# EAGLE design esp12StackFTDI_1 (EAGLE 7.7.0)

## Sheet 1 of 2
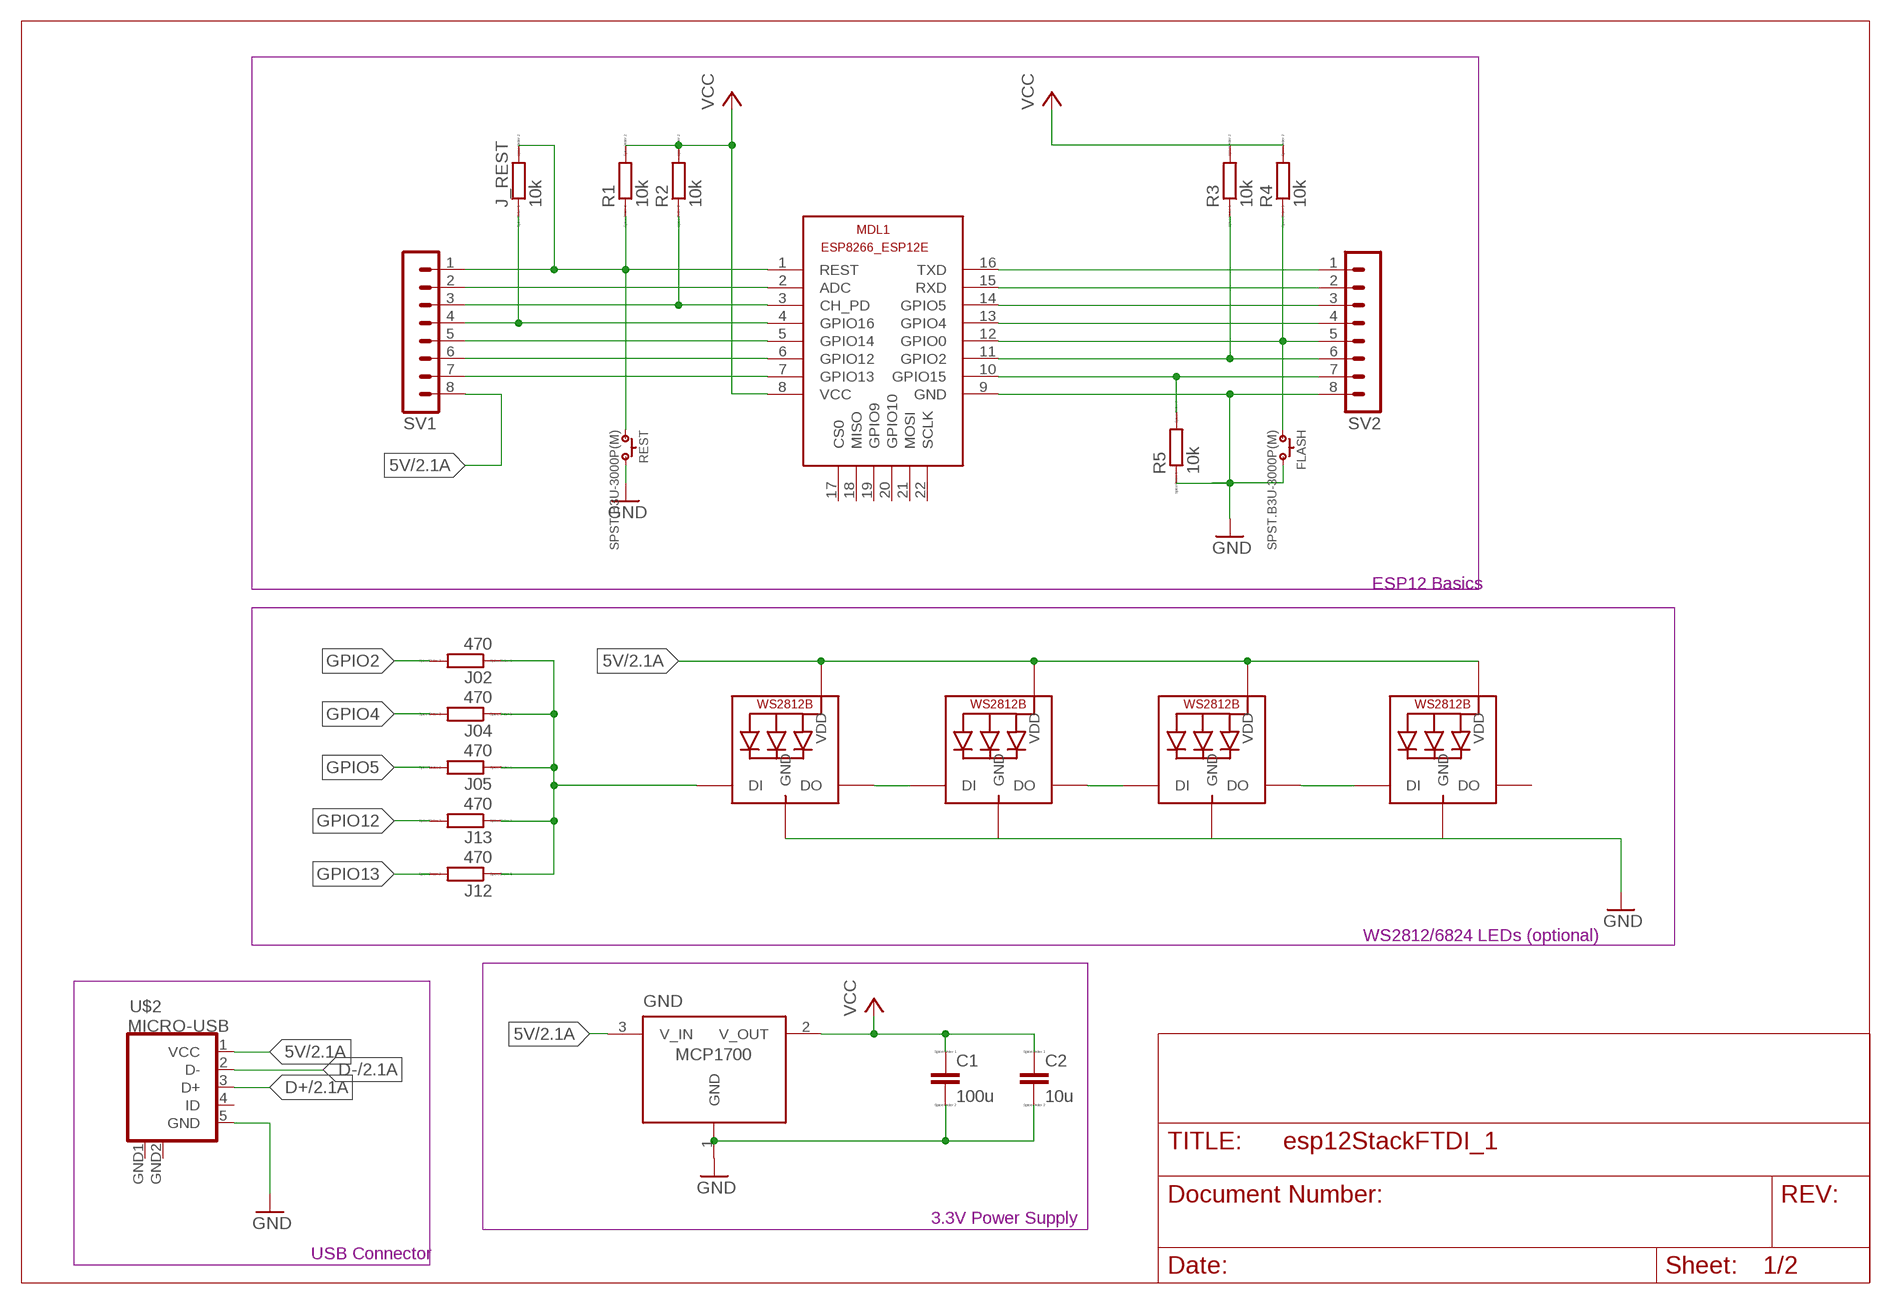
[diagram p0: schematic, sheet 1]

### Parts
C1  100u  C  [C0805]
C2  10u  C  [C0805]
FLASH  SPST.B3U-3000P(M)  [B3U-3000P(M)]
GND  MCP1700SOT23  [SOT-23]
J02  470  RR0603  [R0603]
J04  470  RR0603  [R0603]
J05  470  RR0603  [R0603]
J12  470  RR0603  [R0603]
J13  470  RR0603  [R0603]
J_REST  10k  RR0603  [R0603]
LED1  WS2812B5050  [WS2812B]
LED2  WS2812B5050  [WS2812B]
LED3  WS2812B5050  [WS2812B]
LED4  WS2812B5050  [WS2812B]
MDL1  ESP8266-12EESP8266-ESP12E  [ESP8266-ESP12E]
R1  10k  RR0603  [R0603]
R2  10k  RR0603  [R0603]
R3  10k  RR0603  [R0603]
R4  10k  RR0603  [R0603]
R5  10k  RR0603  [R0603]
REST  SPST.B3U-3000P(M)  [B3U-3000P(M)]
SV1  MA08-1  [MA08-1]
SV2  MA08-1  [MA08-1]
U$2  MICRO-USB  [MICRO-USB]

### Nets
3V3: C1.1 C2.1 GND.2(V_OUT) MDL1.8(VCC) R1.2 R2.2 R3.2 R4.2 ; supply symbol labelled VCC ; also sheet 2
5V: GND.3(V_IN) LED1.1-VDD(VDD) LED2.1-VDD(VDD) LED3.1-VDD(VDD) LED4.1-VDD(VDD) SV1.8 U$2.1(VCC) ; also sheet 2
ADC: MDL1.2(ADC) SV1.2
CH_PD: MDL1.3(CH_PD) R2.1 SV1.3
D+: U$2.3(D+) ; also sheet 2
D-: U$2.2(D-) ; also sheet 2
DIN1: J02.1 J04.1 J05.1 J12.1 J13.1 LED1.4-DIN(DI)
DOUT1DIN2: LED1.2-DOUT(DO) LED2.4-DIN(DI)
DOUT2DIN3: LED2.2-DOUT(DO) LED3.4-DIN(DI)
DOUT3DIN4: LED3.2-DOUT(DO) LED4.4-DIN(DI)
GND: C1.2 C2.2 FLASH.2 GND.1(GND) LED1.3-GND(GND) LED2.3-GND(GND) LED3.3-GND(GND) LED4.3-GND(GND) MDL1.9(GND) R5.1 REST.2 SV2.8 U$2.5(GND) ; also sheet 2
GPIO0: FLASH.1 MDL1.12(GPIO0) R4.1 SV2.5
GPIO2: J02.2 MDL1.11(GPIO2) R3.1 SV2.6
GPIO4: J04.2 MDL1.13(GPIO4) SV2.4
GPIO5: J05.2 MDL1.14(GPIO5) SV2.3
GPIO12: J13.2 MDL1.6(GPIO12) SV1.6
GPIO13: J12.2 MDL1.7(GPIO13) SV1.7
GPIO14: MDL1.5(GPIO14) SV1.5
GPIO15: MDL1.10(GPIO15) R5.2 SV2.7
GPIO16: J_REST.1 MDL1.4(GPIO16) SV1.4
REST: J_REST.2 MDL1.1(REST) R1.1 REST.1 SV1.1
RXD: MDL1.15(RXD) SV2.2 ; also sheet 2
TXD: MDL1.16(TXD) SV2.1 ; also sheet 2
Unconnected: LED4.2-DOUT(DO) MDL1.17(CS0) MDL1.18(MISO) MDL1.19(GPIO9) MDL1.20(GPIO10) MDL1.21(MOSI) MDL1.22(SCLK) U$2.4(ID)

### Notes on the sheet
- ESP12 Basics
- WS2812/6824 LEDs (optional)
- 3.3V Power Supply
- USB Connector

## Sheet 2 of 2
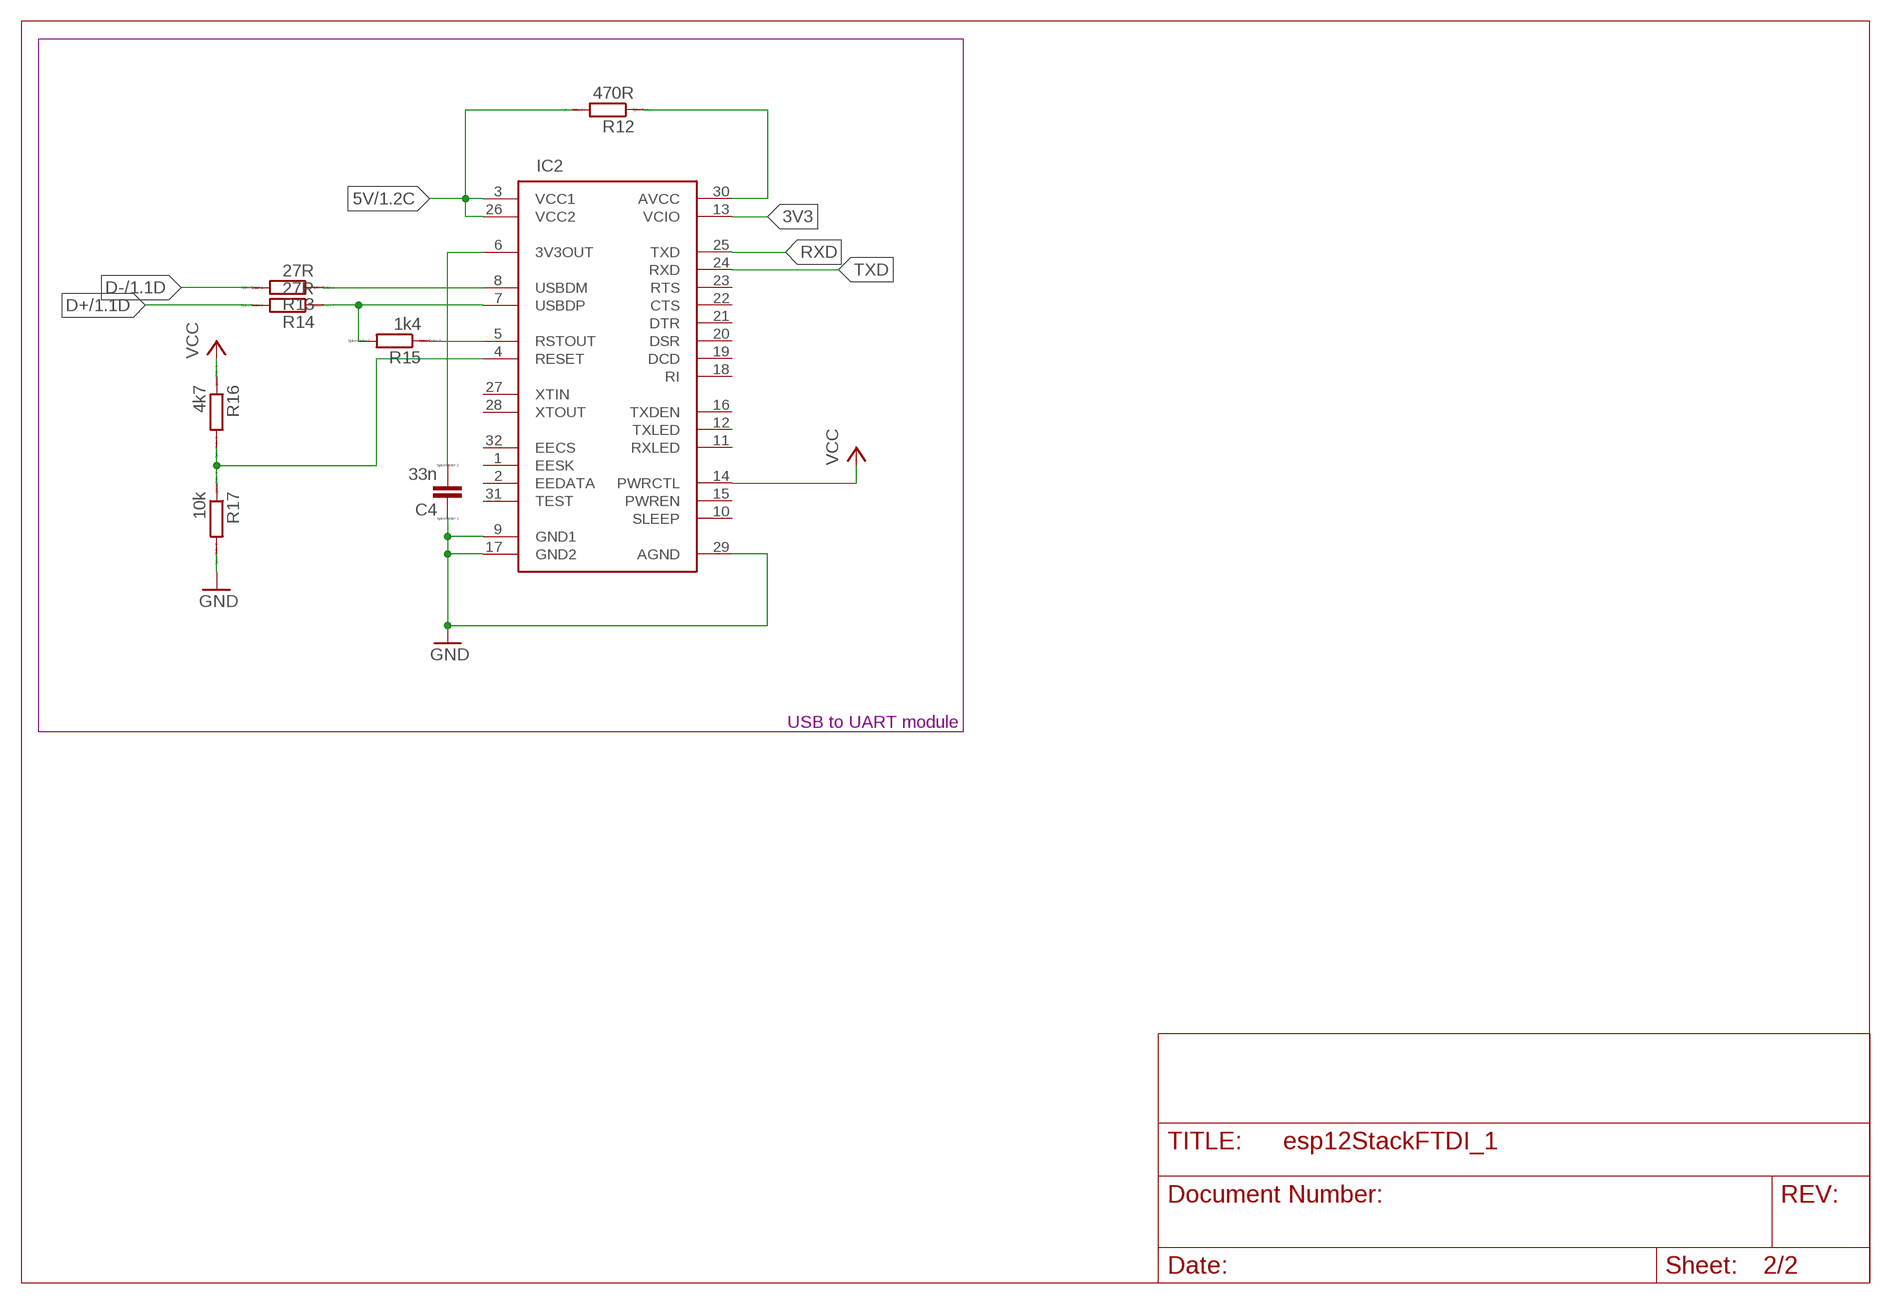
[diagram p1: schematic, sheet 2]

### Parts
C4  33n  CC0603  [C0603]
IC2  FT232BM  [QFP-32]
R12  470R  RR0603  [R0603]
R13  27R  RR0603  [R0603]
R14  27R  RR0603  [R0603]
R15  1k4  RR0603  [R0603]
R16  4k7  RR0603  [R0603]
R17  10k  RR0603  [R0603]

### Nets
3V3: IC2.13(VCIO) IC2.14(PWRCTL) ; supply symbol labelled VCC ; also sheet 1
3V3OUT1: C4.2 IC2.6(3V3OUT)
5V: IC2.3(VCC1) IC2.26(VCC2) R12.2 R16.1 ; supply symbol labelled VCC ; also sheet 1
AVCC1: IC2.30(AVCC) R12.1
D+: R14.2 ; also sheet 1
D-: R13.2 ; also sheet 1
GND: C4.1 IC2.9(GND1) IC2.17(GND2) IC2.29(AGND) R17.2 ; also sheet 1
RESET1: IC2.4(RESET) R16.2 R17.1
RSTOUT1: IC2.5(RSTOUT) R15.1
RXD: IC2.25(TXD) ; also sheet 1
TXD: IC2.24(RXD) ; also sheet 1
USBDM1: IC2.8(USBDM) R13.1
USBDP1: IC2.7(USBDP) R14.1 R15.2
Unconnected: IC2.1(EESK) IC2.2(EEDATA) IC2.10(SLEEP) IC2.11(RXLED) IC2.12(TXLED) IC2.15(PWREN) IC2.16(TXDEN) IC2.18(RI) IC2.19(DCD) IC2.20(DSR) IC2.21(DTR) IC2.22(CTS) IC2.23(RTS) IC2.27(XTIN) IC2.28(XTOUT) IC2.31(TEST) IC2.32(EECS)

### Notes on the sheet
- USB to UART module

## Power pins joined to a net without a drawn wire
GND: U$2.GND1(GND) U$2.GND2(GND)

## Library data of the parts
C1 C2 C4 = eagle-ltspice:C: CAPACITOR, European symbol; SPICEMODEL: NONE; SPICEPREFIX: C
FLASH REST = omron:SPST
GND = MCP1700:MCP1700SOT23
IC2 = FTDI:FT232BM: FT232BM USB-RS232 Wandler FTDI
J02 J04 J05 J12 J13 J_REST R1-R5 R12-R17 = eagle-ltspice:R: RESISTOR, European symbol; SPICEMODEL: NONE; SPICEPREFIX: R
LED1-LED4 = adafruit:WS2812B
MDL1 = ESP12E:ESP8266-12E: ESP8266-12E with additional I/O and GPIO04/05 corrected The author cannot warrant that this library is free from error or will meet your specific requirements. Created by PuceBaboon.com. Komagane, Nagano, JAPAN
SV1 SV2 = con-lstb:MA08-1: PIN HEADER; OC_FARNELL: unknown; OC_NEWARK: unknown
U$2 = microusb (1):MICRO-USB: Micro USB B connector

## Board
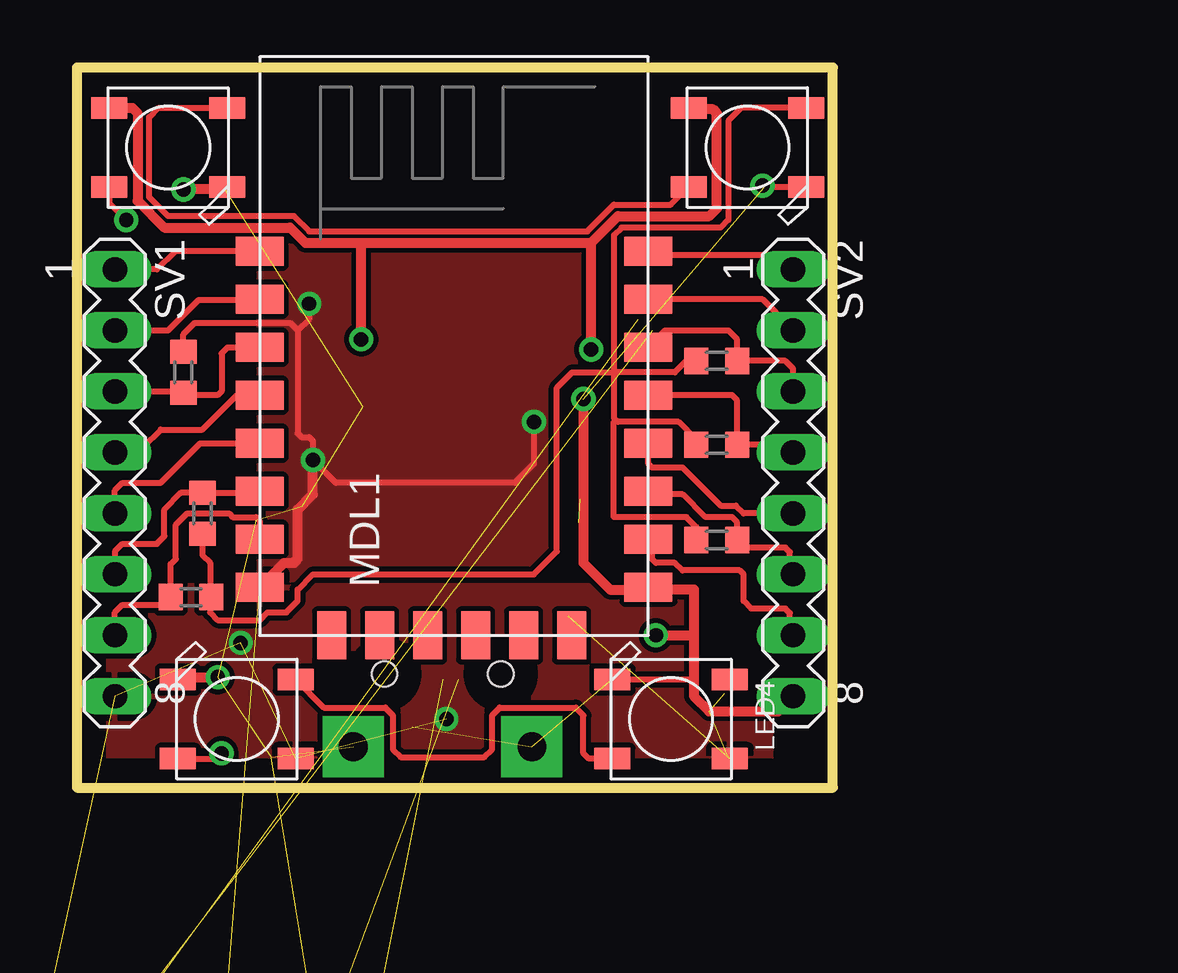
[diagram p2: board, top side]
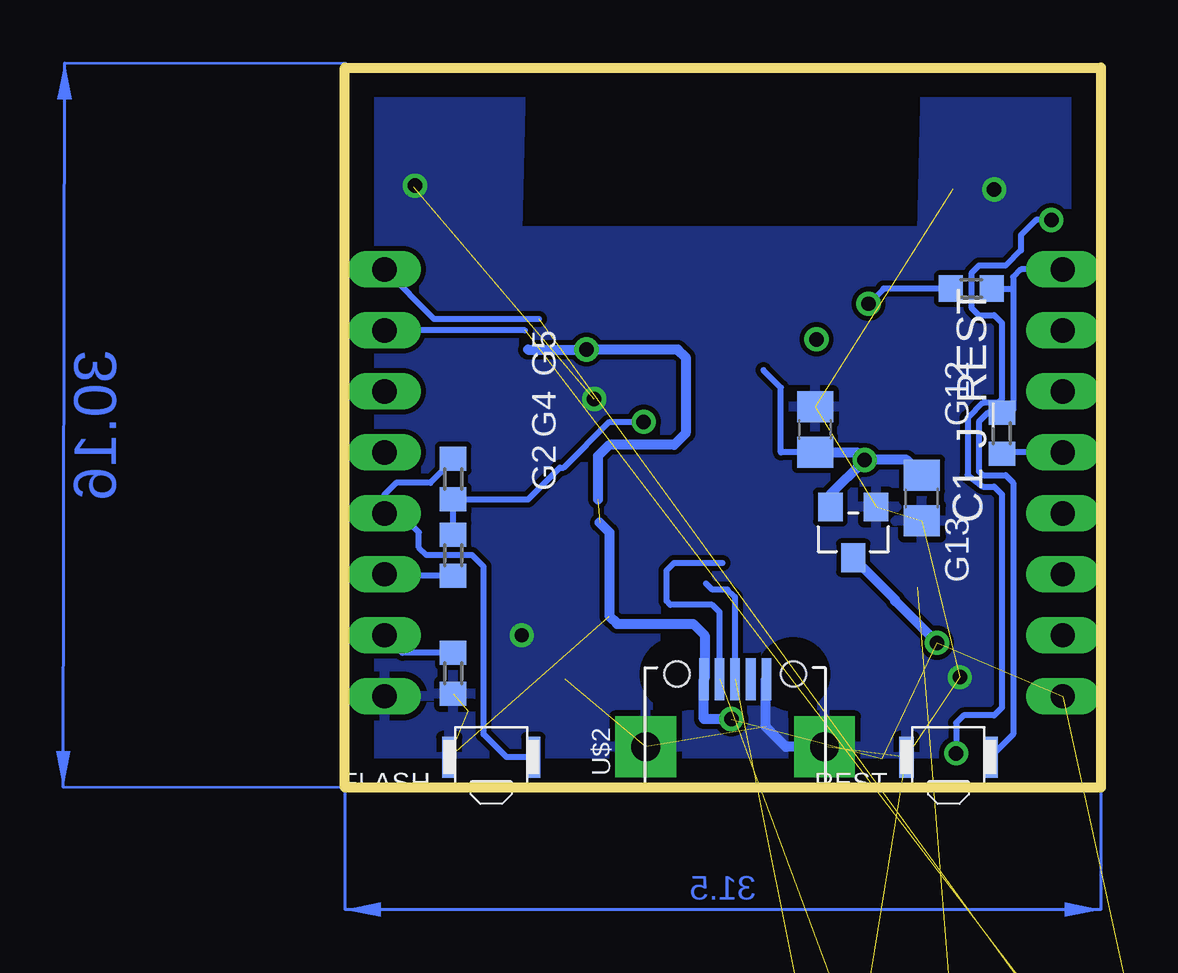
[diagram p3: board, bottom side, seen from below]

Size 31.5 x 30 mm. Coordinates in mm from the lower left corner, seen from the top.
Outline: 0,0 31.5,0 31.5,30 0,30 0,0
Copper layers (1*16): Top 0.035mm / dielectric 1.5mm / Bottom 0.035mm
Design rules "default": minimum track width 10mil, minimum drill 24mil, track to track 8mil, track to pad 8mil, pad to pad 8mil, via to via 8mil, smd to smd 8mil, copper to edge 40mil, drill to drill 8mil, minimum pad ring 10mil, minimum via ring 8mil, stop-mask expansion 4mil, vias tented up to drill 0mil, thermal gap 10mil

### Footprints (pad centres in the part's own frame; a part is rotated, then mirrored left to right if it is on the bottom)
C0805 = smd 1.3 x 1.5: 1 -0.95,0; 2 0.95,0
C0603 = smd 1.1 x 1: 1 -0.85,0; 2 0.85,0
B3U-3000P(M) = smd 0.6 x 1.7: 1 -1.75,0; 2 1.75,0
SOT-23 = smd 1.016 x 1.2: 1 -0.95,-1.06; 2 0.95,-1.06; 3 0,1.06
QFP-32 = smd 0.508 x 1.6: 1 -2.8,-4.25; 2 -2,-4.25; 3 -1.2,-4.25; 4 -0.4,-4.25; 5 0.4,-4.25; 6 1.2,-4.25; 7 2,-4.25; 8 2.8,-4.25; 17 2.8,4.25; 18 2,4.25; 19 1.2,4.25; 20 0.4,4.25; 21 -0.4,4.25; 22 -1.2,4.25; 23 -2,4.25; 24 -2.8,4.25 | smd 1.6 x 0.508: 9 4.25,-2.8; 10 4.25,-2; 11 4.25,-1.2; 12 4.25,-0.4; 13 4.25,0.4; 14 4.25,1.2; 15 4.25,2; 16 4.25,2.8; 25 -4.25,2.8; 26 -4.25,2; 27 -4.25,1.2; 28 -4.25,0.4; 29 -4.25,-0.4; 30 -4.25,-1.2; 31 -4.25,-2; 32 -4.25,-2.8
R0603 = smd 1 x 1.1: 1 -0.85,0; 2 0.85,0
WS2812B = smd 1.5 x 0.9: 1-VDD 2.45,-1.65; 2-DOUT 2.45,1.65; 3-GND -2.45,1.65; 4-DIN -2.45,-1.65
ESP8266-ESP12E = smd 2 x 1.2: 1 0,16; 2 0,14; 3 0,12; 4 0,10; 5 0,8; 6 0,6; 7 0,4; 8 0,2; 9 16.2,2; 10 16.2,4; 11 16.2,6; 12 16.2,8; 13 16.2,10; 14 16.2,12; 15 16.2,14; 16 16.2,16 | smd 1.2 x 2: 17 11,0; 18 3,0; 19 5,0; 20 13,0; 21 7,0; 22 9,0
MA08-1 = drill 1.016 long: 1 -8.89,0; 2 -6.35,0; 3 -3.81,0; 4 -1.27,0; 5 1.27,0; 6 3.81,0; 7 6.35,0; 8 8.89,0
MICRO-USB = smd 0.4 x 1.75: 1 -1.3,4.525; 2 -0.65,4.525; 3 0,4.525; 4 0.65,4.525; 5 1.3,4.525 | drill 1.2 pad 2.54 square: GND1 -3.725,1.7; GND2 3.725,1.7 | hole 1.05: -2.425,4.73; 2.425,4.73

### Placement (x,y rotation side)
C1  7.46,12.06 270 bottom
C2  11.91,14.92 90 bottom
C4  11.43,-13.97 0 top  (outside the outline)
FLASH  25.4,1.27 180 bottom
GND  10.32,10.64 180 bottom
IC2  1.27,-19.05 0 top  (outside the outline)
J02  26.67,10.32 0 top
J04  26.67,14.29 0 top
J05  26.67,17.78 0 top
J12  4.76,7.94 180 top
J13  5.24,11.43 90 top
J_REST  4.13,14.76 90 bottom
LED1  27.94,26.67 180 top
LED2  3.81,26.67 180 top
LED3  6.67,2.86 0 top
LED4  24.77,2.86 0 top
MDL1  7.62,6.35 0 top
R1  5.4,20.8 180 bottom
R2  4.45,17.3 90 top
R3  26.99,9.68 90 bottom
R4  26.99,12.86 270 bottom
R5  26.99,4.76 90 bottom
R12  -3.81,-29.21 0 top  (outside the outline)
R13  2.54,-29.21 0 top  (outside the outline)
R14  7.62,-29.21 0 top  (outside the outline)
R15  -3.81,-34.29 0 top  (outside the outline)
R16  1.27,-34.29 0 top  (outside the outline)
R17  6.35,-34.29 0 top  (outside the outline)
REST  6.35,1.27 180 bottom
SV1  1.59,12.7 270 top
SV2  29.84,12.7 270 top
U$2  15.24,0 0 bottom

### Tracks (layer width: path | path; a pad name or v marks a point on that pad's centre or on a via)
3V3  (via drill 0.6)  (2 unrouted)
  Top 0.254: R2.2 4.45,18.89 4.92,19.37 8.89,19.37 9.21,19.05 | 9.21,19.05 9.21,14.76 9.37,14.61 9.68,14.61 9.84,14.45 v9.84,13.65 10.79,12.7 18.26,12.7 19.05,13.49 v19.05,15.24 | v9.68,20.16 9.68,19.53 9.21,19.05
  Top 0.406: MDL1.8 8.64,9.37 9.05,9.37 9.21,9.53 9.21,11.59 9.84,12.22 v9.84,13.65
  Bottom 0.254: 14.06,17.39 13.33,16.67 13.33,13.97 C2.1 | R1.2 9.05,20.8 v9.68,20.16 | R3.2 R4.2 23.87,12.01 22.54,13.34 22.38,13.34 20.48,15.24 v19.05,15.24
  Bottom 0.406: GND.2 11.27,12.22 v9.84,13.65 | C2.1 10.16,13.97 v9.84,13.65 | C1.1 8.1,13.65 v9.84,13.65
  pour Top: 7.62,22.86 23.81,22.86 23.81,6.35 7.62,6.35
3V3OUT1  (1 unrouted)
5V  (via drill 0.6)  (9 unrouted)
  Top 0.254: 25.55,28.26 LED1.1-VDD
  Top 0.406: LED2.1-VDD 2.32,28.32 2.54,28.1 2.54,24.45 3.65,23.34 8.89,23.34 9.53,22.7 11.91,22.7 | 25.55,28.26 26.51,28.26 26.67,28.1 26.67,24.13 26.35,23.81 22.54,23.81 21.43,22.7 | 11.91,22.7 21.43,22.7 | v11.85,18.68 11.85,22.64 11.91,22.7 | v21.43,18.26 21.43,22.7
  Bottom 0.254: 16.51,4.55 U$2.1
  Bottom 0.406: 16.51,4.55 16.51,6.35 16.99,6.83 20.16,6.83 20.48,7.14 20.48,10.64 20.89,11.04 | GND.3 8.57,7.83 8.57,7.78 v6.83,6.03 | v15.4,2.86 16.54,2.86 U$2.1 | 20.95,12.01 20.95,13.81 20.48,14.29 17.78,14.29 17.3,14.76 17.3,17.94 17.62,18.26 v21.43,18.26 23.87,18.26
  pour Top: 0,8.41 28.89,8.41 28.89,0 0,0
ADC
  Top 0.254: 7.54,20.34 MDL1.2 7.59,20.32 5.08,20.32 3.81,19.05 SV1.2
AVCC1  (1 unrouted)
CH_PD
  Top 0.254: 6.92,18.35 MDL1.3 6.29,18.35 6.03,18.1 6.03,16.51 5.87,16.35 4.55,16.35 R2.1 4.39,16.51 SV1.3
D+  (1 unrouted)
  Bottom 0.254: U$2.3 15.24,7.94 15.56,8.26 16.19,8.26 16.45,8.52
D-  (1 unrouted)
  Bottom 0.254: U$2.2 15.89,7.32 16.19,7.62 17.94,7.62 18.1,7.78 18.1,9.05 17.78,9.37 15.77,9.37
DIN1
  Top 0.254: J13.1 5.24,9.68 5.56,9.37 5.56,7.99 | 5.56,7.99 J12.1 | 5.56,7.99 5.56,7.3 5.87,6.99 7.62,6.99 7.94,7.3 8.73,7.3 9.21,7.78 9.21,8.26 9.84,8.89 19.05,8.89 20,9.84 20,16.67 20.64,17.3 22.38,17.3 | J02.1 25.82,10.85 25.4,11.27 22.38,11.27 22.38,15.24 22.54,15.24 | J04.1 25.82,14.5 25.08,15.24 22.54,15.24 | LED1.4-DIN 27.68,28.32 27.15,27.78 27.15,23.65 26.83,23.34 22.7,23.34 22.38,23.02 22.38,17.3 | 22.38,17.3 22.38,15.4 22.54,15.24 | J05.1 25.4,17.78 24.92,17.3 22.38,17.3
DOUT1DIN2
  Top 0.254: 25.56,24.95 LED1.2-DOUT 24.76,24.29 22.38,24.29 21.27,23.18 9.68,23.18 9.05,23.81 3.81,23.81 3.02,24.61 3.02,27.94 3.4,28.32 LED2.4-DIN
DOUT2DIN3  (via drill 0.6)
  Top 0.254: LED2.2-DOUT 1.36,24.36 v2.06,23.65 | LED3.4-DIN 5.81,1.21 v6.03,1.43
  Bottom 0.254: v2.06,23.65 2.7,23.65 3.33,23.02 3.33,22.38 3.97,21.75 5.08,21.75 5.4,21.43 5.4,20 5.08,19.68 4.45,19.68 4.13,19.37 4.13,16.19 4.29,16.03 4.92,16.03 5.56,15.4 5.56,13.02 4.92,12.54 4.45,12.54 4.13,12.22 4.13,3.33 4.45,3.02 5.71,3.02 6.03,2.7 v6.03,1.43
DOUT3DIN4
  Top 0.254: LED4.4-DIN 21.34,1.21 21.11,1.43 21.11,3.02 20.8,3.33 17.62,3.33 17.3,3.02 17.3,1.59 16.99,1.27 13.49,1.27 13.18,1.59 13.18,3.02 12.86,3.33 10.29,3.33 LED3.2-DOUT
GND  (via drill 0.6)  (16 unrouted)
  Top 0.254: LED4.3-GND 25.72,4.51 25.72,3.81 | LED1.3-GND 28.64,25.02 v28.57,25.08
  Top 0.406: LED3.3-GND 4.28,4.45 4.44,4.6 v5.87,4.6 | 25.72,6.35 25.72,8.26 23.91,8.26 MDL1.9 23.73,8.26 22.23,8.26 21.11,9.37 v21.11,16.19 | 25.72,6.35 25.72,3.81 26.35,3.17 29.21,3.17 SV2.8 | LED2.3-GND 6.16,24.92 v4.45,24.92 | v24.13,6.35 25.72,6.35
  Bottom 0.406: U$2.GND2 13.13,1.7 13.97,2.54 13.97,4.5 U$2.5
  pour Bottom: 0,0 0,30.16 7.3,30.16 7.46,23.18 24.29,23.18 24.13,30.16 31.43,30.16 31.43,0
GPIO0
  Top 0.254: SV2.5 27.78,11.43 27.46,11.75 26.83,11.75 25.24,13.34 23.97,13.34 23.81,13.49 MDL1.12
  Bottom 0.254: R4.1 26.99,13.65 27.94,12.7 29.37,12.7 29.84,12.22 SV2.5 29.21,11.43 28.42,10.64 28.42,10 28.1,9.68 26.19,9.68 25.72,9.21 25.72,2.22 24.77,1.27 FLASH.1
GPIO2
  Top 0.254: SV2.6 29.72,8.91 29.72,9.81 29.53,10 27.84,10 J02.2 27.52,11.06 27.3,11.27 26.19,11.27 25.24,12.22 23.95,12.22 MDL1.11
  Bottom 0.254: R3.1 29.79,8.83 SV2.6
GPIO4
  Top 0.254: SV2.4 29.53,14.29 J04.2 27.52,16.14 27.3,16.35 MDL1.13
GPIO5
  Top 0.254: SV2.3 29.84,17.46 29.53,17.78 J05.2 27.52,18.68 27.15,19.05 24.5,19.05 MDL1.14
GPIO12
  Top 0.254: 7.54,12.34 MDL1.6 7.55,12.28 J13.2 4.34,12.28 3.65,11.59 3.65,10.48 3.33,10.16 1.91,10.16 1.59,9.84 SV1.6 1.6,8.91
GPIO13
  Top 0.254: MDL1.7 6.86,10.35 | 7.17,10.35 MDL1.7 | SV1.7 1.59,7.3 1.91,7.62 3.6,7.62 J12.2 3.91,9.31 4.13,9.53 4.13,10.95 4.6,11.43 6.35,11.43 6.51,11.27 7.46,11.27 7.62,11.11 MDL1.7
  Top 0.406: MDL1.7 7.62,10.16
GPIO14
  Top 0.254: 7.54,14.17 MDL1.5 | SV1.5 1.59,12.38 1.91,12.7 3.49,12.7 5.14,14.35 MDL1.5 | 7.56,14.29 MDL1.5
GPIO15
  Top 0.254: SV2.7 29.72,6.4 29.72,7.27 29.53,7.46 28.1,7.46 27.78,7.78 27.78,8.89 27.62,9.05 25.24,9.05 24.92,9.37 24.13,9.37 23.97,9.53 23.97,10.2 MDL1.10
  Bottom 0.254: 29.69,6.19 SV2.7 29.11,5.61 R5.2
GPIO16
  Top 0.254: 7.54,16.23 MDL1.4 6.67,16.35 5.24,14.92 3.49,14.92 2.74,14.17 1.6,14.17 SV1.4
  Bottom 0.254: SV1.4 4.39,13.97 J_REST.1
RESET1  (2 unrouted)
REST
  Top 0.254: MDL1.1 4.09,22.35 3.33,21.59 SV1.1
  Bottom 0.254: SV1.1 3.33,21.59 3.65,21.27 3.65,20.8 | REST.1 3.65,2.22 3.65,12.7 3.97,13.02 4.92,13.02 5.08,13.18 5.08,15.24 4.71,15.61 J_REST.2 4.39,15.56 3.81,15.56 3.65,15.72 3.65,20.8 | R1.1 3.65,20.8
RSTOUT1  (1 unrouted)
RXD  (1 unrouted)
  Top 0.254: MDL1.15 24,20.34 28.57,20.34 29.72,19.2 SV2.2
  Bottom 0.254: 23.99,19.05 SV2.2
TXD  (1 unrouted)
  Top 0.254: SV2.1 29.26,22.17 24,22.17 MDL1.16
  Bottom 0.254: 23.4,19.53 27.78,19.53 SV2.1
USBDM1  (1 unrouted)
USBDP1  (2 unrouted)
(copper drawn outside any net)
  shapes: Bottom area x2

### Text on the board
bNames: G12 | G5 | G4 | G2 | G13